# Altium project Telephone.PrjPcb (part 6 of 6)

## Sheet DTMF.SchDoc: DTMF
size A4; Organization: ORGANIZATION; Address1: ADDRESS 1; Address2: ADDRESS 2; Address3: ADDRESS 3; Address4: ADDRESS 4; Revision: -; SheetNumber: 8; SheetTotal: 11; ENG_APP_DATE: --/--/--; DSN_APP_DATE: --/--/--; CHK_APP_DATE: --/--/--
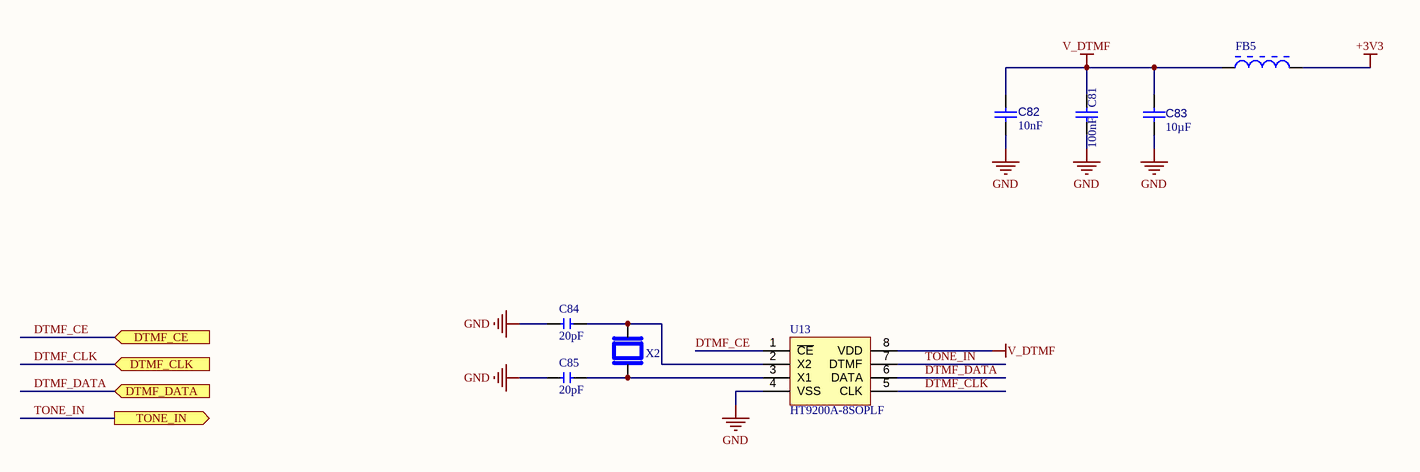
[diagram p12: DTMF.SchDoc]

### Parts
C81  value 100nF  [C0603]  (hidden comment: CC0603KRX7R8BB104)
C82  value 10nF  [C0603]  (hidden comment: 06035C103KAT2A)
C83  value 10µF  [0805]  (hidden comment: C0805C106K9PACTU)
C84  value 20pF  [0805]  (hidden comment: CMP-001-00183-1)
C85  value 20pF  [0805]  (hidden comment: CMP-001-00183-1)
FB5  CMP-006-00051-1  [R0603]  (value not drawn)
U13  HT9200A-8SOPLF  [SSOIC8]
X2  CMP-003-00038-1  [XTAL]  (value not drawn)

### Ports
DTMF_CE (in), DTMF_CLK (in), DTMF_DATA (in), TONE_IN (out)

### Nets
+3V3: FB5.2
GND: C81.2 C82.2 C83.1 C84.1 C85.1 U13.4(VSS)
V_DTMF: C81.1 C82.1 C83.2 FB5.1 U13.8(VDD)
DTMF_CE: U13.1(~{CE}) ; port DTMF_CE
DTMF_CLK: U13.5(CLK) ; port DTMF_CLK
DTMF_DATA: U13.6(DATA) ; port DTMF_DATA
TONE_IN: U13.7(DTMF) ; port TONE_IN
NetC84_2: C84.2 U13.2(X2) X2.2
NetC85_2: C85.2 U13.3(X1) X2.1

### Notes on the sheet
- APPROVALS
- DATE
- PROJECT
- Kish Spark Building
- No. 8, Avesta Street
- ENG:
- DSN:
- CHK:
- PROJECT REVISION:
- DESIGN ITEM:
- DOCUMENT REVISION:
- Tehran, Iran
- Seoul Street, Sheikh Bahaie
- SIZE
- REV
- SCALE:
- CAGE CODE
- A4
- FILE NAME
- TITLE
- SHEET
- OF

### Library data of the parts
C81 = CMP-001-00108-2: YAGEO - CC0603KRX7R8BB104 - CERAMIC CAPACITOR, 0.1UF, 25V, X7R, 10%, 0603, FULL REEL; Case/Package: 0603; Pins: 2; RoHS Compliant: Yes; Min Operating Temperature: -55°C; Max Operating Temperature: 125°C; Voltage Rating: 25V; Tolerance: 10%; Design Item ID: CC0603KRX7R8BB104; Case Code (Metric): 1608; Category: Ceramic Capacitors; Depth: 0.8mm; Dielectric: X7R; Halogen Free: Halogen Free; Height: 0.8mm; Lead Free: Lead Free; Length: 1.6mm; Manufacturer 1: Yageo; Manufacturer Part Number 1: CC0603KRX7R8BB104; Mount: Surface Mount; Package Quantity: 1; Packaging: Tape and Reel; Pricing 1: 1=0.10000, 10=0.05000, 50=0.02720, 100=0.02220, 500=0.01586, 1000=0.01246 (USD); Radiation Hardening: No; REACH SVHC: Unknown; Resistor Type: Ceramic; RoHS: Yes; Series: CC; Source: PTZLib.SchLib; Stock 1: 4053185; Termination: SMD/SMT; Thickness: 0.035inch; Voltage: 25V; Voltage Rating (DC): 25V; Width: 0.8mm; ComponentLink1Description: https://datasheet.ciiva.com/144/mlccorderingcode-144075.pdf?src-supplier=Digi-Key; ComponentLink1URL: https://datasheet.ciiva.com/144/mlccorderingcode-144075.pdf?src-supplier=Digi-Key; ComponentLink2Description: https://datasheet.ciiva.com/11786/0900766b80c10176-11786120.pdf?src-supplier=RSComponents; ComponentLink2URL: https://datasheet.ciiva.com/11786/0900766b80c10176-11786120.pdf?src-supplier=RSComponents; ComponentLink3Description: https://datasheet.ciiva.com/7978/1489800-7978155.pdf?src-supplier=Element14; ComponentLink3URL: https://datasheet.ciiva.com/7978/1489800-7978155.pdf?src-supplier=Element14; ComponentLink4Description: https://datasheet.ciiva.com/28450/1489800-28450584.pdf?src-supplier=Element14; ComponentLink4URL: https://datasheet.ciiva.com/28450/1489800-28450584.pdf?src-supplier=Element14; ComponentLink5Description: https://datasheet.ciiva.com/144/mlccorderingcode-144074.pdf?src-supplier=Digi-Key; ComponentLink5URL: https://datasheet.ciiva.com/144/mlccorderingcode-144074.pdf?src-supplier=Digi-Key; ComponentLink6Description: https://datasheet.ciiva.com/144/mlccorderingcode-144073.pdf?src-supplier=Digi-Key; ComponentLink6URL: https://datasheet.ciiva.com/144/mlccorderingcode-144073.pdf?src-supplier=Digi-Key; ComponentLink7Description: https://datasheet.ciiva.com/13389/upy-gphc-x7r-6-3v-to-50v-8-13389352.pdf?src-supplier=Mouser; ComponentLink7URL: https://datasheet.ciiva.com/13389/upy-gphc-x7r-6-3v-to-50v-8-13389352.pdf?src-supplier=Mouser; ComponentLink8Description: https://datasheet.ciiva.com/11587/upy-gphc-x7r-6-3v-to-50v-8-11587208.pdf?src-supplier=Avnet; ComponentLink8URL: https://datasheet.ciiva.com/11587/upy-gphc-x7r-6-3v-to-50v-8-11587208.pdf?src-supplier=Avnet; ComponentLink9Description: https://datasheet.ciiva.com/26829/getdatasheetpartid-403577-26829431.pdf?src-supplier=Verical; ComponentLink9URL: https://datasheet.ciiva.com/26829/getdatasheetpartid-403577-26829431.pdf?src-supplier=Verical; ComponentLink10Description: https://datasheet.ciiva.com/17434/upy-gphc-x7r-6-3v-to-50v-8-17434263.pdf?src-supplier=Avnet+Europe; ComponentLink10URL: https://datasheet.ciiva.com/17434/upy-gphc-x7r-6-3v-to-50v-8-17434263.pdf?src-supplier=Avnet+Europe
C82 = CMP-001-00096-2: 0603 10nF 50 V ±10 % Tolerance X7R Surface Mount Multilayer Ceramic Capacitor; Manufacturer: Kyocera AVX; Voltage Rating: 50V; Tolerance: 10%; Dissipation Factor: 2.5%; Insulation Resistance: 100GR; Case/Package: 0603; Pins: 2; Min Operating Temperature: -55°C; Max Operating Temperature: 125°C; Design Item ID: 06035C103KAT2A; Case Code (Metric): 1608; Category: Ceramic Capacitors; Contact Plating: Tin,Matte; Depth: 0.81mm; Dielectric: X7R; Dielectric Material: Ceramic; Height: 0.9mm; Lead Free: Lead Free; Length: 1.6mm; Manufacturer Part Number: 06035C103KAT2A; Mount: Surface Mount,PCB; Packaging: Tape and Reel; Radiation Hardening: No; REACH SVHC: No SVHC; RoHS: Yes; Stock 1: 4334081; Termination: SMD/SMT; Thickness: 0.035inch; Voltage: 50V; Voltage Rating (DC): 50V; Width: 0.032inch; ComponentLink1Description: https://datasheet.ciiva.com/2987/cx7r-2987824.pdf?src-supplier=Avnet; ComponentLink1URL: https://datasheet.ciiva.com/2987/cx7r-2987824.pdf?src-supplier=Avnet; ComponentLink2Description: https://datasheet.ciiva.com/1124/1679506-1124848.pdf?src-supplier=Element14; ComponentLink2URL: https://datasheet.ciiva.com/1124/1679506-1124848.pdf?src-supplier=Element14; ComponentLink3Description: https://datasheet.ciiva.com/7855/1679506-7855082.pdf?src-supplier=Element14; ComponentLink3URL: https://datasheet.ciiva.com/7855/1679506-7855082.pdf?src-supplier=Element14; ComponentLink4Description: https://datasheet.ciiva.com/150/cx7r-150227.pdf?src-supplier=Digi-Key; ComponentLink4URL: https://datasheet.ciiva.com/150/cx7r-150227.pdf?src-supplier=Digi-Key; ComponentLink5Description: https://datasheet.ciiva.com/150/cx7r-150229.pdf?src-supplier=Digi-Key; ComponentLink5URL: https://datasheet.ciiva.com/150/cx7r-150229.pdf?src-supplier=Digi-Key
C83 = CMP-001-00180-2: Ceramic Capacitor, 10UF, 6.3V, X5R, 10%, 0805, Full Reel; Manufacturer: KEMET; Dissipation Factor: 5%; Capacitor Type: Ceramic Capacitors; Manufacturer Part Number: C0805C106K9PACTU; Mount: Surface Mount; Case/Package: 0805; Case Code (Metric): 2012; Dielectric Material: Ceramic; Contact Material: Tin; Min Operating Temperature: -55°C; Max Operating Temperature: 85°C; Tolerance: 10%; Voltage Rating (DC): 6.3V; Dielectric: X5R; Packaging: Tape and Reel; Voltage Rating: 6.3V; Series: SMD Comm X5R; Construction: Flat; Length: 2mm; Width: 1.2mm; Height: 1.25mm; Depth: 1.25mm; Lead Pitch: 0.75mm; Radiation Hardening: No; RoHS Compliant: Yes; Lead Free: Lead Free; Reach SVHC Compliant: No; ComponentLink1URL: https://datasheet.ciiva.com/7842/kem-c1006-x5r-smd-7842200.pdf?src-supplier=Element14; ComponentLink1Description: https://datasheet.ciiva.com/7842/kem-c1006-x5r-smd-7842200.pdf?src-supplier=Element14; ComponentLink2URL: https://datasheet.ciiva.com/7842/kem-c1006-x5r-smd-7842201.pdf?src-supplier=Element14; ComponentLink2Description: https://datasheet.ciiva.com/7842/kem-c1006-x5r-smd-7842201.pdf?src-supplier=Element14; ComponentLink3URL: https://datasheet.ciiva.com/7842/40889-7842553.pdf?src-supplier=Element14; ComponentLink3Description: https://datasheet.ciiva.com/7842/40889-7842553.pdf?src-supplier=Element14; ComponentLink4URL: https://datasheet.ciiva.com/7842/40889-7842554.pdf?src-supplier=Element14; ComponentLink4Description: https://datasheet.ciiva.com/7842/40889-7842554.pdf?src-supplier=Element14; ComponentLink5URL: https://datasheet.ciiva.com/18193/getdatasheetpartid-320652-18193500.pdf?src-supplier=Verical; ComponentLink5Description: https://datasheet.ciiva.com/18193/getdatasheetpartid-320652-18193500.pdf?src-supplier=Verical; Pins: 2; Mounting Technology: SMD/SMT
C84 C85 = CMP-001-00183-1: CAP CER 20PF 50V NPO 0805; Manufacturer: Yageo; Tolerance: 5%; Dielectric: NP0; Manufacturer Part Number: CC0805JRNPO9BN200; RoHS: Yes; Category: Ceramic Capacitors; Stock: 3029; Pricing: 1=0.13, 10=0.054, 50=0.054, 100=0.032, 1000=0.026, 10000=0.017 (USD); Mounting Technology: Surface Mount; Case/Package: 0805; Pins: 2; Case Code (Metric): 2012; Min Operating Temperature: -55°C; Max Operating Temperature: 125°C; Voltage Rating: 50V; Packaging: Tape and Reel; Voltage Rating (DC): 50V; Termination: SMD/SMT; Series: CC; Length: 0.079inch; Width: 1.25mm; Thickness: 0.028inch; Lead Free: Lead Free; ComponentLink1URL: https://datasheet.ciiva.com/5427/upy-gp-np0-16v-to-50v-8-5427416.pdf?src-supplier=Mouser; ComponentLink1Description: https://datasheet.ciiva.com/5427/upy-gp-np0-16v-to-50v-8-5427416.pdf?src-supplier=Mouser; Design Item ID: CC0805JRNPO9BN200; Component Type: Standard; Pin Count: 2; Source: V4-TEL.SCHLIB
FB5 = CMP-006-00051-1: Ferrite Beads 0603 60ohm; Manufacturer 1: Murata; Manufacturer Part Number 1: BLM18PG471SN1B; Tolerance: 25%; Impedance: 470R; DC Resistance (DCR): 200mR; Current Rating: 1A; RoHS: Yes; Category: Ferrite Beads and Chips; Case/Package: 0603; Min Operating Temperature: -55°C; Max Operating Temperature: 125°C; Package Quantity: 1000; Packaging: Bulk; ComponentLink1URL: http://www.mouser.com/ds/2/281/c31e-794748.pdf?src-supplier=Mouser; ComponentLink1Description: http://www.mouser.com/ds/2/281/c31e-794748.pdf?src-supplier=Mouser; Pins: 2; Design Item ID: BLM18PG471SN1B; Source: PTZLib.SchLib
U13 = CMP-031-00018-2: IC, Dtmf Generator, SMD, SOP8; Manufacturer: Holtek; Min Supply Voltage: 2.5V; Max Supply Voltage: 5.5V; Nominal Supply Current: 950uA; Manufacturer Part Number: HT9200A-8SOPLF; Category: Integrated Circuits (ICs); Pins: 8; Min Operating Temperature: -20°C; Max Operating Temperature: 75°C; Reach SVHC Compliant: No; ComponentLink1URL: https://datasheet.ciiva.com/1167/1738900-1167188.pdf?src-supplier=Element14; ComponentLink1Description: https://datasheet.ciiva.com/1167/1738900-1167188.pdf?src-supplier=Element14; Component Type: Standard; RoHS Compliant: Yes
X2 = CMP-003-00038-1: Crystal 3.579545MHz ±30ppm (Tol) ±50ppm (Stability) 18pF FUND 180Ohm 2-Pin HC-49/US SMD T/R; Manufacturer: Abracon; Frequency: 3.5795MHz; ESR (Equivalent Series Resistance): 180; Manufacturer Part Number: ABLS-3.579545MHZ-B4-T; RoHS: Yes; Category: Crystals; Stock: 4835; Pricing: 1=0.17, 10=0.138, 50=0.138, 100=0.138, 1000=0.132, 10000=0.108 (USD); Mounting Technology: Surface Mount; Case/Package: SMD/SMT; Min Operating Temperature: -20°C; Max Operating Temperature: 70°C; Packaging: Tape and Reel; Frequency Tolerance: 30ppm; Load Capacitance: 18pF; Package Quantity: 1000; Tolerance: 30ppm; Frequency Stability: 50ppm; Termination: SMD/SMT; ESR: 180; Series: ABLS; Length: 11.4mm; Width: 4.7mm; Height: 4.2mm; Depth: 4.7mm; Radiation Hardening: No; Lead Free: Lead Free; ComponentLink1URL: https://datasheet.ciiva.com/15116/getdatasheetpartid-719920-15116797.pdf?src-supplier=Verical; ComponentLink1Description: https://datasheet.ciiva.com/15116/getdatasheetpartid-719920-15116797.pdf?src-supplier=Verical; ComponentLink2URL: https://datasheet.ciiva.com/854/abls-854168.pdf?src-supplier=Digi-Key; ComponentLink2Description: https://datasheet.ciiva.com/854/abls-854168.pdf?src-supplier=Digi-Key; ComponentLink3URL: https://datasheet.ciiva.com/854/abls-854169.pdf?src-supplier=Digi-Key; ComponentLink3Description: https://datasheet.ciiva.com/854/abls-854169.pdf?src-supplier=Digi-Key; ComponentLink4URL: https://datasheet.ciiva.com/854/abls-854170.pdf?src-supplier=Digi-Key; ComponentLink4Description: https://datasheet.ciiva.com/854/abls-854170.pdf?src-supplier=Digi-Key; ComponentLink5URL: https://datasheet.ciiva.com/4944/abls-44621-4944684.pdf?src-supplier=Mouser; ComponentLink5Description: https://datasheet.ciiva.com/4944/abls-44621-4944684.pdf?src-supplier=Mouser; Pins: 2; Design Item ID: ABLS-3.579545MHZ-B4-T; Component Type: Standard; Source: V4-TEL.SCHLIB

## Sheet MUX.SchDoc: Speaker and Microphone MUX
size A4; Organization: ORGANIZATION; Address1: ADDRESS 1; Address2: ADDRESS 2; Address3: ADDRESS 3; Address4: ADDRESS 4; Revision: -; SheetNumber: 6; SheetTotal: 11; ENG_APP_DATE: --/--/--; DSN_APP_DATE: --/--/--; CHK_APP_DATE: --/--/--
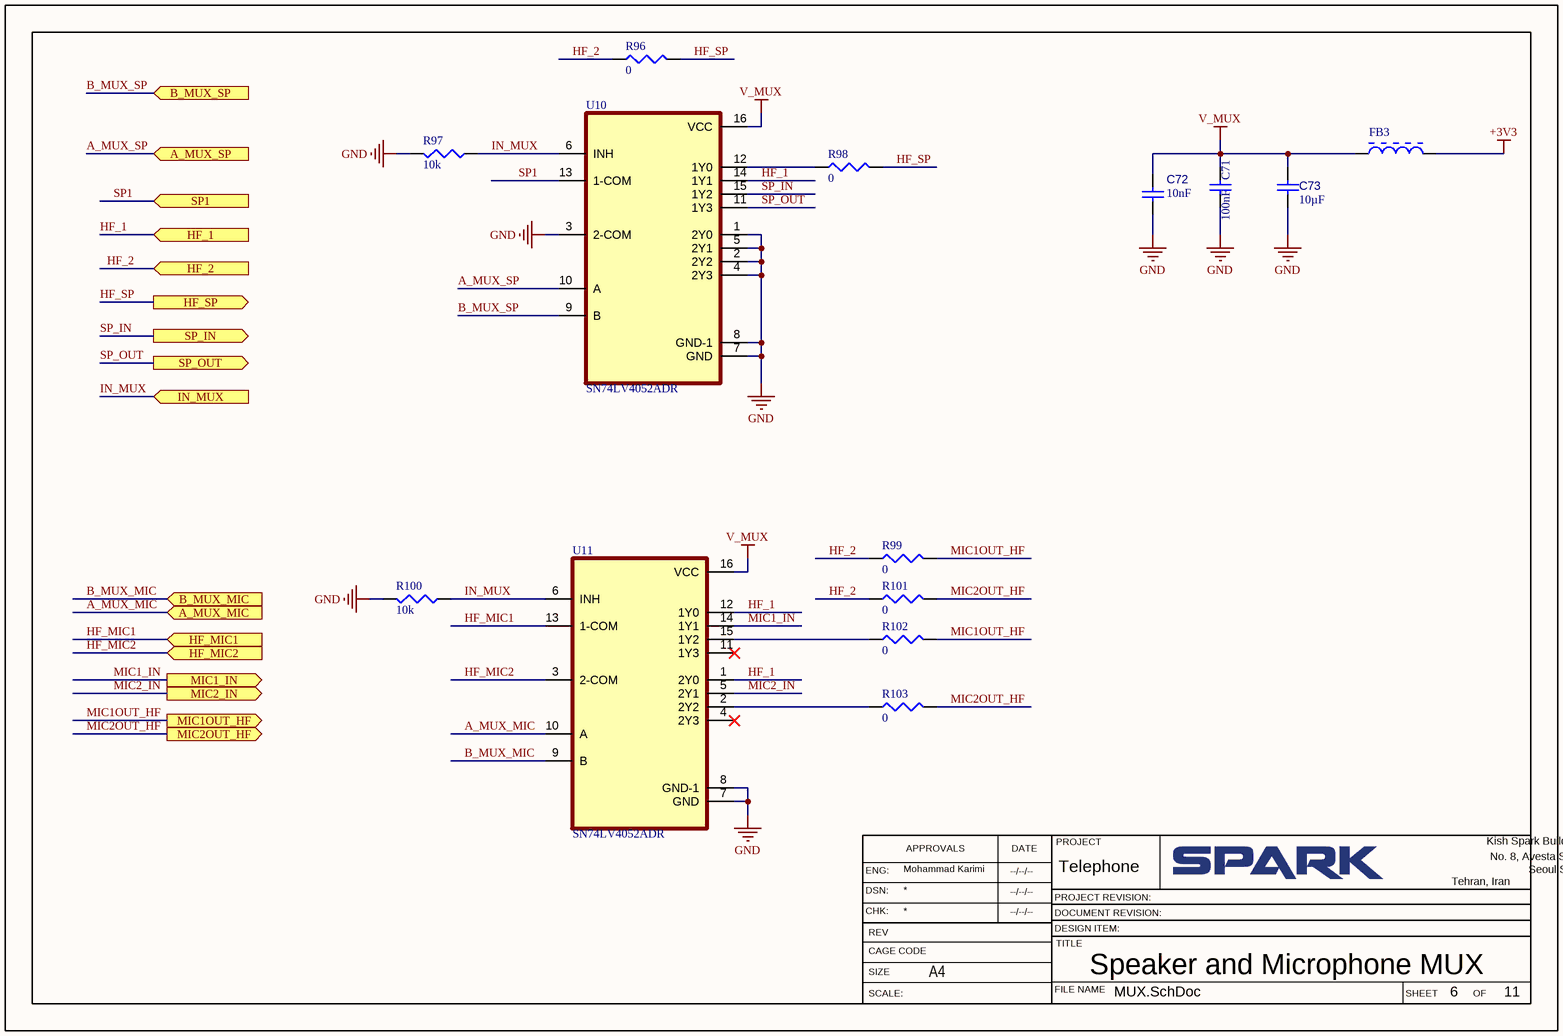
[diagram p13: MUX.SchDoc]

### Parts
C71  value 100nF  [C0603]  (hidden comment: CC0603KRX7R8BB104)
C72  value 10nF  [C0603]  (hidden comment: 06035C103KAT2A)
C73  value 10µF  [0805]  (hidden comment: C0805C106K9PACTU)
FB3  CMP-006-00051-1  [R0603]  (value not drawn)
R96  value 0  [R0603]  (hidden comment: RMCF0603ZT0R00)
R97  value 10k  [R0603]  (hidden comment: CRCW060310K0JNEA)
R98  value 0  [R0603]  (hidden comment: RMCF0603ZT0R00)
R99  value 0  [R0603]  (hidden comment: RMCF0603ZT0R00)
R100  value 10k  [R0603]  (hidden comment: CRCW060310K0JNEA)
R101  value 0  [R0603]  (hidden comment: RMCF0603ZT0R00)
R102  value 0  [R0603]  (hidden comment: RMCF0603ZT0R00)
R103  value 0  [R0603]  (hidden comment: RMCF0603ZT0R00)
U10  SN74LV4052ADR  [demultiplexer]
U11  SN74LV4052ADR  [demultiplexer]

### Ports
A_MUX_MIC (in), A_MUX_SP (in), B_MUX_MIC (in), B_MUX_SP (in), HF_1 (in), HF_2 (in), HF_MIC1 (in), HF_MIC2 (in), HF_SP (out), IN_MUX (in), MIC1_IN (out), MIC1OUT_HF (out), MIC2_IN (out), MIC2OUT_HF (out), SP1 (in), SP_IN (out), SP_OUT (out)

### Nets
+3V3: FB3.2
GND: C71.2 C72.1 C73.1 R97.2 R100.2 U10.1(2Y0) U10.2(2Y2) U10.3(2-COM) U10.4(2Y3) U10.5(2Y1) U10.7(GND) U10.8(GND-1) U11.7(GND) U11.8(GND-1)
V_MUX: C71.1 C72.2 C73.2 FB3.1 U10.16(VCC) U11.16(VCC)
A_MUX_MIC: U11.10(A) ; port A_MUX_MIC
A_MUX_SP: U10.10(A) ; port A_MUX_SP
B_MUX_MIC: U11.9(B) ; port B_MUX_MIC
B_MUX_SP: U10.9(B) ; port B_MUX_SP
HF_1: U10.14(1Y1) U11.1(2Y0) U11.12(1Y0) ; port HF_1
HF_2: R96.1 R99.1 R101.1 ; port HF_2
HF_MIC1: U11.13(1-COM) ; port HF_MIC1
HF_MIC2: U11.3(2-COM) ; port HF_MIC2
HF_SP: R96.2 R98.2 ; port HF_SP
IN_MUX: R97.1 R100.1 U10.6(INH) U11.6(INH) ; port IN_MUX
MIC1_IN: U11.14(1Y1) ; port MIC1_IN
MIC1OUT_HF: R99.2 R102.2 ; port MIC1OUT_HF
MIC2_IN: U11.5(2Y1) ; port MIC2_IN
MIC2OUT_HF: R101.2 R103.2 ; port MIC2OUT_HF
SP1: U10.13(1-COM) ; port SP1
SP_IN: U10.15(1Y2) ; port SP_IN
SP_OUT: U10.11(1Y3) ; port SP_OUT
NetR98_1: R98.1 U10.12(1Y0)
NetR102_1: R102.1 U11.15(1Y2)
NetR103_1: R103.1 U11.2(2Y2)

Not connected (* = marked no-connect by the designer): U11 4(2Y3)* 11(1Y3)*

### Notes on the sheet
- APPROVALS
- DATE
- PROJECT
- Kish Spark Building
- No. 8, Avesta Street
- ENG:
- DSN:
- CHK:
- PROJECT REVISION:
- DESIGN ITEM:
- DOCUMENT REVISION:
- Tehran, Iran
- Seoul Street, Sheikh Bahaie
- SIZE
- REV
- SCALE:
- CAGE CODE
- A4
- FILE NAME
- TITLE
- SHEET
- OF

### Library data of the parts
C71 = CMP-001-00108-2: as C81 on sheet DTMF; Case/Package: 0603; Pins: 2; RoHS Compliant: Yes; Min Operating Temperature: -55°C; Max Operating Temperature: 125°C; Voltage Rating: 25V; Tolerance: 10%; Design Item ID: CC0603KRX7R8BB104; Case Code (Metric): 1608; Category: Ceramic Capacitors; Depth: 0.8mm; Dielectric: X7R; Halogen Free: Halogen Free; Height: 0.8mm; Lead Free: Lead Free; Length: 1.6mm; Manufacturer 1: Yageo; Manufacturer Part Number 1: CC0603KRX7R8BB104; Mount: Surface Mount; Package Quantity: 1; Packaging: Tape and Reel; Pricing 1: 1=0.10000, 10=0.05000, 50=0.02720, 100=0.02220, 500=0.01586, 1000=0.01246 (USD); Radiation Hardening: No; REACH SVHC: Unknown; Resistor Type: Ceramic; RoHS: Yes; Series: CC; Source: PTZLib.SchLib; Stock 1: 4053185; Termination: SMD/SMT; Thickness: 0.035inch; Voltage: 25V; Voltage Rating (DC): 25V; Width: 0.8mm; ComponentLink1Description: https://datasheet.ciiva.com/144/mlccorderingcode-144075.pdf?src-supplier=Digi-Key; ComponentLink1URL: https://datasheet.ciiva.com/144/mlccorderingcode-144075.pdf?src-supplier=Digi-Key; ComponentLink2Description: https://datasheet.ciiva.com/11786/0900766b80c10176-11786120.pdf?src-supplier=RSComponents; ComponentLink2URL: https://datasheet.ciiva.com/11786/0900766b80c10176-11786120.pdf?src-supplier=RSComponents; ComponentLink3Description: https://datasheet.ciiva.com/7978/1489800-7978155.pdf?src-supplier=Element14; ComponentLink3URL: https://datasheet.ciiva.com/7978/1489800-7978155.pdf?src-supplier=Element14; ComponentLink4Description: https://datasheet.ciiva.com/28450/1489800-28450584.pdf?src-supplier=Element14; ComponentLink4URL: https://datasheet.ciiva.com/28450/1489800-28450584.pdf?src-supplier=Element14; ComponentLink5Description: https://datasheet.ciiva.com/144/mlccorderingcode-144074.pdf?src-supplier=Digi-Key; ComponentLink5URL: https://datasheet.ciiva.com/144/mlccorderingcode-144074.pdf?src-supplier=Digi-Key; ComponentLink6Description: https://datasheet.ciiva.com/144/mlccorderingcode-144073.pdf?src-supplier=Digi-Key; ComponentLink6URL: https://datasheet.ciiva.com/144/mlccorderingcode-144073.pdf?src-supplier=Digi-Key; ComponentLink7Description: https://datasheet.ciiva.com/13389/upy-gphc-x7r-6-3v-to-50v-8-13389352.pdf?src-supplier=Mouser; ComponentLink7URL: https://datasheet.ciiva.com/13389/upy-gphc-x7r-6-3v-to-50v-8-13389352.pdf?src-supplier=Mouser; ComponentLink8Description: https://datasheet.ciiva.com/11587/upy-gphc-x7r-6-3v-to-50v-8-11587208.pdf?src-supplier=Avnet; ComponentLink8URL: https://datasheet.ciiva.com/11587/upy-gphc-x7r-6-3v-to-50v-8-11587208.pdf?src-supplier=Avnet; ComponentLink9Description: https://datasheet.ciiva.com/26829/getdatasheetpartid-403577-26829431.pdf?src-supplier=Verical; ComponentLink9URL: https://datasheet.ciiva.com/26829/getdatasheetpartid-403577-26829431.pdf?src-supplier=Verical; ComponentLink10Description: https://datasheet.ciiva.com/17434/upy-gphc-x7r-6-3v-to-50v-8-17434263.pdf?src-supplier=Avnet+Europe; ComponentLink10URL: https://datasheet.ciiva.com/17434/upy-gphc-x7r-6-3v-to-50v-8-17434263.pdf?src-supplier=Avnet+Europe
C72 = CMP-001-00096-2: as C82 on sheet DTMF; Case/Package: 0603; Pins: 2; Min Operating Temperature: -55°C; Max Operating Temperature: 125°C; Design Item ID: 06035C103KAT2A; Case Code (Metric): 1608; Category: Ceramic Capacitors; Contact Plating: Tin,Matte; Depth: 0.81mm; Dielectric: X7R; Dielectric Material: Ceramic; Height: 0.9mm; Lead Free: Lead Free; Length: 1.6mm; Manufacturer Part Number: 06035C103KAT2A; Mount: Surface Mount,PCB; Packaging: Tape and Reel; Radiation Hardening: No; REACH SVHC: No SVHC; RoHS: Yes; Stock 1: 4334081; Termination: SMD/SMT; Thickness: 0.035inch; Voltage: 50V; Voltage Rating (DC): 50V; Width: 0.032inch; ComponentLink1Description: https://datasheet.ciiva.com/2987/cx7r-2987824.pdf?src-supplier=Avnet; ComponentLink1URL: https://datasheet.ciiva.com/2987/cx7r-2987824.pdf?src-supplier=Avnet; ComponentLink2Description: https://datasheet.ciiva.com/1124/1679506-1124848.pdf?src-supplier=Element14; ComponentLink2URL: https://datasheet.ciiva.com/1124/1679506-1124848.pdf?src-supplier=Element14; ComponentLink3Description: https://datasheet.ciiva.com/7855/1679506-7855082.pdf?src-supplier=Element14; ComponentLink3URL: https://datasheet.ciiva.com/7855/1679506-7855082.pdf?src-supplier=Element14; ComponentLink4Description: https://datasheet.ciiva.com/150/cx7r-150227.pdf?src-supplier=Digi-Key; ComponentLink4URL: https://datasheet.ciiva.com/150/cx7r-150227.pdf?src-supplier=Digi-Key; ComponentLink5Description: https://datasheet.ciiva.com/150/cx7r-150229.pdf?src-supplier=Digi-Key; ComponentLink5URL: https://datasheet.ciiva.com/150/cx7r-150229.pdf?src-supplier=Digi-Key
C73 = CMP-001-00180-2: as C83 on sheet DTMF; Manufacturer Part Number: C0805C106K9PACTU; Mount: Surface Mount; Case/Package: 0805; Case Code (Metric): 2012; Dielectric Material: Ceramic; Contact Material: Tin; Min Operating Temperature: -55°C; Max Operating Temperature: 85°C; Tolerance: 10%; Voltage Rating (DC): 6.3V; Dielectric: X5R; Packaging: Tape and Reel; Voltage Rating: 6.3V; Series: SMD Comm X5R; Construction: Flat; Length: 2mm; Width: 1.2mm; Height: 1.25mm; Depth: 1.25mm; Lead Pitch: 0.75mm; Radiation Hardening: No; RoHS Compliant: Yes; Lead Free: Lead Free; Reach SVHC Compliant: No; ComponentLink1URL: https://datasheet.ciiva.com/7842/kem-c1006-x5r-smd-7842200.pdf?src-supplier=Element14; ComponentLink1Description: https://datasheet.ciiva.com/7842/kem-c1006-x5r-smd-7842200.pdf?src-supplier=Element14; ComponentLink2URL: https://datasheet.ciiva.com/7842/kem-c1006-x5r-smd-7842201.pdf?src-supplier=Element14; ComponentLink2Description: https://datasheet.ciiva.com/7842/kem-c1006-x5r-smd-7842201.pdf?src-supplier=Element14; ComponentLink3URL: https://datasheet.ciiva.com/7842/40889-7842553.pdf?src-supplier=Element14; ComponentLink3Description: https://datasheet.ciiva.com/7842/40889-7842553.pdf?src-supplier=Element14; ComponentLink4URL: https://datasheet.ciiva.com/7842/40889-7842554.pdf?src-supplier=Element14; ComponentLink4Description: https://datasheet.ciiva.com/7842/40889-7842554.pdf?src-supplier=Element14; ComponentLink5URL: https://datasheet.ciiva.com/18193/getdatasheetpartid-320652-18193500.pdf?src-supplier=Verical; ComponentLink5Description: https://datasheet.ciiva.com/18193/getdatasheetpartid-320652-18193500.pdf?src-supplier=Verical; Pins: 2; Mounting Technology: SMD/SMT
FB3 = CMP-006-00051-1: as FB5 on sheet DTMF; RoHS: Yes; Category: Ferrite Beads and Chips; Case/Package: 0603; Min Operating Temperature: -55°C; Max Operating Temperature: 125°C; Package Quantity: 1000; Packaging: Bulk; ComponentLink1URL: http://www.mouser.com/ds/2/281/c31e-794748.pdf?src-supplier=Mouser; ComponentLink1Description: http://www.mouser.com/ds/2/281/c31e-794748.pdf?src-supplier=Mouser; Pins: 2; Design Item ID: BLM18PG471SN1B; Source: PTZLib.SchLib
R96 R98 R99 R101-R103 = CMP-009-00195-1: Res Thkflm 0603 0 Ohm Jumper 1/10W 100Ppm/ C Smd Rohs Compliant: Yes; Manufacturer 1: Stackpole Electronics; Current Rating: 1A; Max Power Dissipation: 100mW; Working Voltage: 75V; Case/Package: 0603; RoHS Compliant: Yes; Min Operating Temperature: -55°C; Max Operating Temperature: 155°C; Design Item ID: RMCF0603ZT0R00; Case Code (Metric): 1608; Category: Chip SMD Resistors; Construction: Rectangular; Contact Plating: Tin,Matte; Depth: 0.8mm; Features: Automotive AEC-Q200; Height: 0.022inch; Lead Free: Lead Free; Length: 1.55mm; Manufacturer Part Number 1: RMCF0603ZT0R00; Military Standard: Not; Mount: Surface Mount; Number of Terminations: 2; Packaging: Tape and Reel; Power Rating: 100mW; Pricing 1: 1=0.10000, 10=0.01300, 25=0.00960, 50=0.00720, 100=0.00530, 250=0.00404, 500=0.00324, 1000=0.00238 (USD); Radiation Hardening: No; Resistor Type: Thick Film; RoHS: Yes; Series: RMCF; Source: PTZLib.SchLib; Stock 1: 617251; Width: 0.031inch; ComponentLink1Description: https://www.seielect.com/catalog/SEI-Packaging.pdf?src-supplier=Digi-Key; ComponentLink1URL: https://www.seielect.com/catalog/SEI-Packaging.pdf?src-supplier=Digi-Key; ComponentLink2Description: https://www.seielect.com/Catalog/SEI-RMCF_RMCP.pdf?src-supplier=Digi-Key; ComponentLink2URL: https://www.seielect.com/Catalog/SEI-RMCF_RMCP.pdf?src-supplier=Digi-Key; ComponentLink3Description: https://www.seielect.com/catalog/SEI-Packaging.pdf?src-supplier=Arrow+Electronics; ComponentLink3URL: https://www.seielect.com/catalog/SEI-Packaging.pdf?src-supplier=Arrow+Electronics; ComponentLink4Description: https://www.seielect.com/catalog/SEI-Packaging.pdf?src-supplier=Avnet; ComponentLink4URL: https://www.seielect.com/catalog/SEI-Packaging.pdf?src-supplier=Avnet; ComponentLink5Description: https://www.seielect.com/catalog/SEI-Packaging.pdf?src-supplier=Verical; ComponentLink5URL: https://www.seielect.com/catalog/SEI-Packaging.pdf?src-supplier=Verical
R97 R100 = CMP-009-00213-1: as R19-R21 on sheet EEPROM; Case/Package: 0603; Pins: 2; RoHS Compliant: Yes; Min Operating Temperature: -55°C; Max Operating Temperature: 155°C; Tolerance: 5%; Design Item ID: CRCW060310K0JNEA; Case Code (Metric): 1608; Category: Chip SMD Resistors; Construction: Rectangular; Contact Plating: Tin; Depth: 0.85mm; Features: Automotive AEC-Q200; Height: 0.02inch; Lead Free: Lead Free; Length: 1.55mm; Manufacturer Part Number 1: CRCW060310K0JNEA; Military Standard: Not; Mount: Surface Mount; Number of Terminations: 2; Package Quantity: 1; Packaging: Tape and Reel; Power Rating: 100mW; Pricing 1: 1=0.10000, 10=0.03300, 100=0.01360, 1000=0.00610, 2500=0.00529 (USD); Radiation Hardening: No; REACH SVHC: Unknown; Resistance Tolerance: 5%; Resistor Type: Thick Film; RoHS: Yes; Series: CRCW; Size Code: 0603; Source: PTZLib.SchLib; Stock 1: 41; Termination: SMD/SMT; Voltage Rating (DC): 75V; Weight: 7.1E-05oz; Width: 0.033inch; ComponentLink1Description: https://datasheet.ciiva.com/3256/dcrcwe3-3256943.pdf?src-supplier=Avnet; ComponentLink1URL: https://datasheet.ciiva.com/3256/dcrcwe3-3256943.pdf?src-supplier=Avnet; ComponentLink2Description: https://datasheet.ciiva.com/2461/dcrcwe3-2461971.pdf?src-supplier=Digi-Key; ComponentLink2URL: https://datasheet.ciiva.com/2461/dcrcwe3-2461971.pdf?src-supplier=Digi-Key; ComponentLink3Description: https://datasheet.ciiva.com/2461/dcrcwe3-2461972.pdf?src-supplier=Digi-Key; ComponentLink3URL: https://datasheet.ciiva.com/2461/dcrcwe3-2461972.pdf?src-supplier=Digi-Key; ComponentLink4Description: https://datasheet.ciiva.com/2461/dcrcwe3-2461973.pdf?src-supplier=Digi-Key; ComponentLink4URL: https://datasheet.ciiva.com/2461/dcrcwe3-2461973.pdf?src-supplier=Digi-Key; ComponentLink5Description: https://datasheet.ciiva.com/3256/dcrcwe3-3256942.pdf?src-supplier=Avnet; ComponentLink5URL: https://datasheet.ciiva.com/3256/dcrcwe3-3256942.pdf?src-supplier=Avnet; ComponentLink6Description: https://datasheet.ciiva.com/16343/dcrcwe3-16343525.pdf?src-supplier=Future+Electronics; ComponentLink6URL: https://datasheet.ciiva.com/16343/dcrcwe3-16343525.pdf?src-supplier=Future+Electronics; ComponentLink7Description: https://datasheet.ciiva.com/16755/70201119-16755717.pdf?src-supplier=Allied+Electronics; ComponentLink7URL: https://datasheet.ciiva.com/16755/70201119-16755717.pdf?src-supplier=Allied+Electronics; ComponentLink8Description: https://datasheet.ciiva.com/16515/dcrcwe3-16515020.pdf?src-supplier=Avnet+Asia; ComponentLink8URL: https://datasheet.ciiva.com/16515/dcrcwe3-16515020.pdf?src-supplier=Avnet+Asia; ComponentLink9Description: https://datasheet.ciiva.com/16771/70201119-16771051.pdf?src-supplier=Allied+Electronics; ComponentLink9URL: https://datasheet.ciiva.com/16771/70201119-16771051.pdf?src-supplier=Allied+Electronics
U10 U11 = CMP-031-00021-1: IC MULTIPLEXER DUAL 4X1 16SOIC; Manufacturer: Texas Instruments; Bandwidth: 50MHz; Propagation Delay: 12ns; Number of Inputs: 8; Number of Outputs: 2; Min Supply Voltage: 2V; Max Supply Voltage: 5.5V; Operating Supply Current: 20uA; Number of Bits: 4; Logic Function: Multiplexer,Demultiplexer; On-State Resistance: 100R; Supply Type: Single; Polarity: Non-Inverting; Throw Configuration: SP4T; Manufacturer Part Number: SN74LV4052ADR; RoHS: Yes; Category: Decoders and Multiplexers; Stock 1: 5424; Pricing 1: 1=0.42, 10=0.355, 50=0.355, 100=0.26, 1000=0.17, 10000=0.136 (USD); Mount: Surface Mount; Case/Package: SOIC; Weight: 0.004998oz; Min Operating Temperature: -40°C; Max Operating Temperature: 85°C; Packaging: Tape and Reel; Package Quantity: 1; Number of Channels: 2; Number of Circuits: 2; Series: 74LV; Number of Switches: 2; Supply Current: 20uA; Radiation Hardening: No; Lead Free: Lead Free; RoHS Compliant: Yes; Reach SVHC Compliant: No; ComponentLink1URL: https://datasheet.ciiva.com/1669/sn74lv4052a-1669728.pdf?src-supplier=Digi-Key; ComponentLink1Description: https://datasheet.ciiva.com/1669/sn74lv4052a-1669728.pdf?src-supplier=Digi-Key; ComponentLink2URL: https://datasheet.ciiva.com/15127/getdatasheetpartid-296403-15127637.pdf?src-supplier=Verical; ComponentLink2Description: https://datasheet.ciiva.com/15127/getdatasheetpartid-296403-15127637.pdf?src-supplier=Verical; ComponentLink3URL: https://datasheet.ciiva.com/46435/1845014-46435855.pdf?src-supplier=Element14; ComponentLink3Description: https://datasheet.ciiva.com/46435/1845014-46435855.pdf?src-supplier=Element14; ComponentLink4URL: https://datasheet.ciiva.com/1669/sn74lv4052a-1669727.pdf?src-supplier=Digi-Key; ComponentLink4Description: https://datasheet.ciiva.com/1669/sn74lv4052a-1669727.pdf?src-supplier=Digi-Key; ComponentLink5URL: https://datasheet.ciiva.com/1669/sn74lv4052a-1669729.pdf?src-supplier=Digi-Key; ComponentLink5Description: https://datasheet.ciiva.com/1669/sn74lv4052a-1669729.pdf?src-supplier=Digi-Key; ComponentLink6URL: https://datasheet.ciiva.com/14306/sn74lv4052a-14306682.pdf?src-supplier=Avnet; ComponentLink6Description: https://datasheet.ciiva.com/14306/sn74lv4052a-14306682.pdf?src-supplier=Avnet; ComponentLink7URL: https://datasheet.ciiva.com/48711/001048022-da-01-en-ic-mp-sn74lv40-sn74lv4052adr-soic-16-tid-48711974.pdf?src-supplier=Conrad; ComponentLink7Description: https://datasheet.ciiva.com/48711/001048022-da-01-en-ic-mp-sn74lv40-sn74lv4052adr-soic-16-tid-48711974.pdf?src-supplier=Conrad; Pins: 16; Design Item ID: SN74LV4052ADR; Component Type: Standard; Pin Count: 16; Source: V4-TEL.SCHLIB

## Nets that join several sheets
+3V3: DryContact (R93.2), Telephone (R47.2), MCU (C14.1 FB1.2), Power (5 pins), EEPROM (FB2.2), CallerID (R108.2), DTMF (FB5.2), MUX (FB3.2)
GND: TopLevel (6 pins), DryContact (Q13.1), Telephone (54 pins), MCU (20 pins), Power (9 pins), Peripheral (R89.3), EEPROM (5 pins), CallerID (7 pins), DTMF (6 pins), MUX (14 pins)
MCU_3.3V: Telephone (J11.2), MCU (20 pins)
VDD: Telephone (9 pins), Power (R1.1)
VPP: TopLevel (J19.2), Telephone (C40.1 Q9.3 R58.2 U6.22), Power (R2.1), Peripheral (R90.1), CallerID (FB4.2)
A_MUX_MIC: MCU (U4.54), MUX (U11.10)
A_MUX_SP: MCU (U4.33), MUX (U10.10)
Anode_LCD: TopLevel (J19.19), Peripheral (R90.2)
B_MUX_MIC: MCU (U4.27), MUX (U11.9)
B_MUX_SP: MCU (U4.34), MUX (U10.9)
BUZZER1: TopLevel (J15.6), Telephone (C53.2)
BUZZER2: TopLevel (J15.5), Telephone (9 pins)
C1: TopLevel (J18.8), MCU (U4.14)
C2: TopLevel (J18.9), MCU (U4.23)
C3: TopLevel (J18.10), MCU (U4.41)
C4: TopLevel (J18.11), MCU (U4.42)
CD_EN: MCU (U4.26), CallerID (R106.2 U12.5)
CD_OUT: MCU (U4.43), CallerID (Q14.3 R108.1)
CLK/HFI: Telephone (C46.2 R61.2 TP18.1), MCU (U4.51)
CS1: TopLevel (J19.15), MCU (U4.39)
CS2: TopLevel (J19.16), MCU (U4.40)
D0: TopLevel (J19.7), MCU (U4.8)
D1: TopLevel (J19.8), MCU (U4.9)
D2: TopLevel (J19.9), MCU (U4.10)
D3: TopLevel (J19.10), MCU (U4.11)
D4: TopLevel (J19.11), MCU (U4.24)
D5: TopLevel (J19.12), MCU (U4.25)
D6: TopLevel (J19.13), MCU (U4.37)
D7: TopLevel (J19.14), MCU (U4.38)
DETI: Telephone (R68.1), MCU (R15.1)
DI/xPD: Telephone (C45.2 R60.2 TP17.1), MCU (U4.53)
DPN: Telephone (R46.1), MCU (U4.5)
DRY_C1: TopLevel (P65.3), DryContact (R92.2 Triac1.OUT)
DRY_C2: TopLevel (P65.4), DryContact (C70.1 R95.1 Triac1.COM)
DRY_IN: DryContact (R94.1), MCU (U4.6)
DTMF_CE: MCU (U4.22), DTMF (U13.1)
DTMF_CLK: MCU (R18.2 U4.21), DTMF (U13.5)
DTMF_DATA: MCU (R16.2 U4.20), DTMF (U13.6)
EEPROM_SCL: MCU (U4.57), EEPROM (R20.1 U5.6)
EEPROM_SDA: MCU (U4.58), EEPROM (R21.2 U5.5)
EEPROM_WP: MCU (U4.56), EEPROM (R19.1 U5.7)
EN: TopLevel (J19.6), MCU (U4.4)
EN_POWER: MCU (U4.35), Power (R3.2)
FCI: Telephone (R47.1 TP14.1 U7.4), MCU (U4.45)
HF: TopLevel (R110.1), Telephone (D5.2 R54.2), MCU (R17.2)
HF_1: TopLevel (P64.9), MUX (U10.14 U11.1 U11.12)
HF_2: TopLevel (P64.10), MUX (R96.1 R99.1 R101.1)
HF_MIC1: Telephone (C24.2 R29.1 R33.2), MUX (U11.13)
HF_MIC2: Telephone (C28.1 J5.1 J5.2 R35.2), MUX (U11.3)
HF_SP: TopLevel (P64.6), MUX (R96.2 R98.2)
HS: TopLevel (J16.1), Telephone (D6.2 R53.2), MCU (R9.2)
HS_2: TopLevel (J16.2 J18.1), Telephone (D2.1 Q4.1 R34.1 R62.1)
HS_MIC1: TopLevel (J15.10), Telephone (C29.2 R30.1 R38.2)
HS_MIC2: TopLevel (J15.9), Telephone (C32.2 R38.1 R39.2)
HS_SP1: TopLevel (J15.8), Telephone (J9.3)
IN_MUX: MCU (U4.55), MUX (R97.1 R100.1 U10.6 U11.6)
MIC1_IN: TopLevel (J15.4), MUX (U11.14)
MIC1OUT_HF: TopLevel (P64.8), MUX (R99.2 R102.2)
MIC2_IN: TopLevel (J15.3), MUX (U11.5)
MIC2OUT_HF: TopLevel (P64.7), MUX (R101.2 R103.2)
NetJ17_1: TopLevel (J17.1), Power (R4.2 TP5.1)
NetJ17_2: TopLevel (J17.2), Power (TP4.1 U2.3)
NetP65_1: TopLevel (P65.1), Power (U2.2)
NetP65_2: TopLevel (P65.2), Power (U2.1)
R1: TopLevel (R111.1), MCU (U4.59)
R2: TopLevel (R112.1), MCU (U4.61)
R3: TopLevel (R113.1), MCU (U4.62)
R4: TopLevel (R114.1), MCU (U4.29)
R5: TopLevel (R115.1), MCU (U4.30)
RING: TopLevel (J14.2 P64.1), Telephone (C65.2 D3.1 R32.1 TP9.1), CallerID (C80.2)
RS: TopLevel (J19.4), MCU (U4.2)
RST: TopLevel (J19.17), MCU (U4.36)
RW: TopLevel (J19.5), MCU (U4.3)
SP1: Telephone (R56.2), MUX (U10.13)
SP_IN: TopLevel (J15.2), MUX (U10.15)
SP_OUT: TopLevel (P64.4), MUX (U10.11)
TIP: TopLevel (J14.1 P64.2), Telephone (C64.2 D3.2 R26.1 TP7.1), CallerID (C79.2)
TONE_IN: Telephone (R25.1), MCU (R16.1 R18.1), DTMF (U13.7)
VO_CONTRAST: TopLevel (J19.18), Peripheral (R89.1)
VO_LCD: TopLevel (J19.3), Peripheral (R89.2)
xCS/xMUTE: Telephone (C44.2 R59.2 TP16.1), MCU (U4.52)

## Assembly variants
Variant of Telephone: not fitted C18 C?